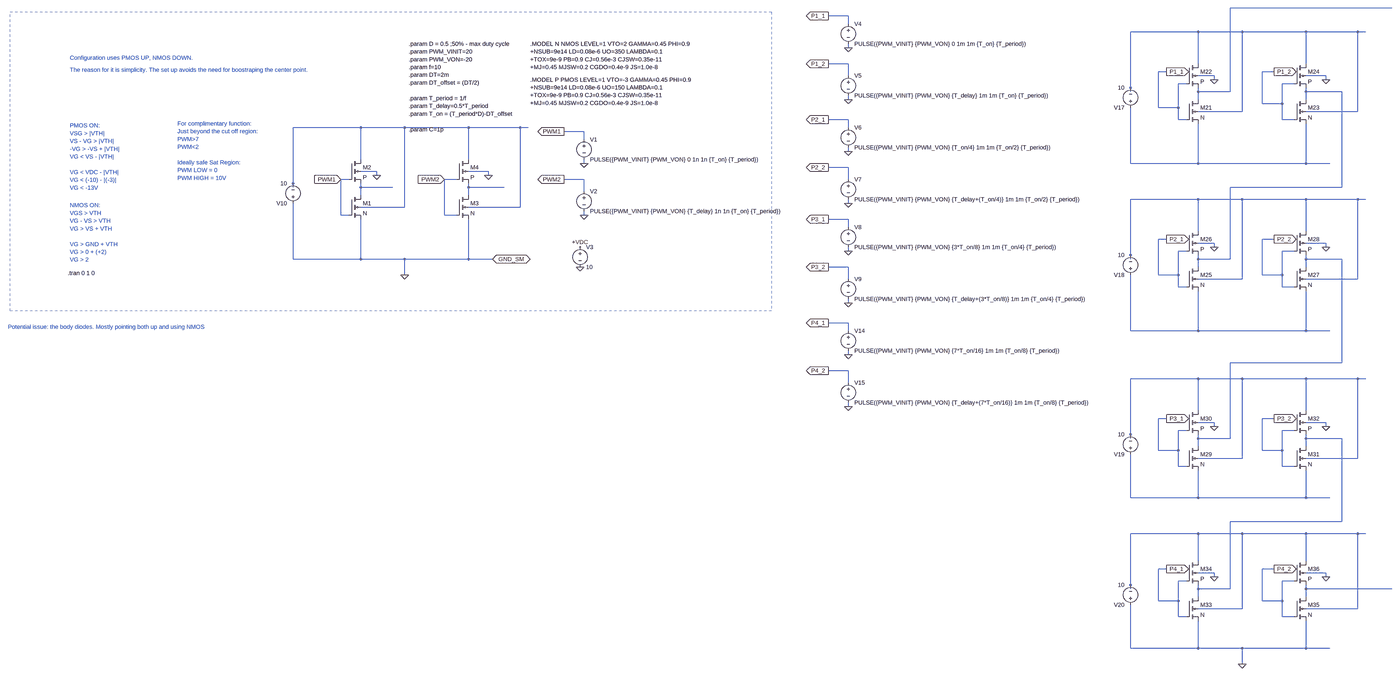
[diagram p0: schematic H-Bridge-4-SM.asc, whole sheet]
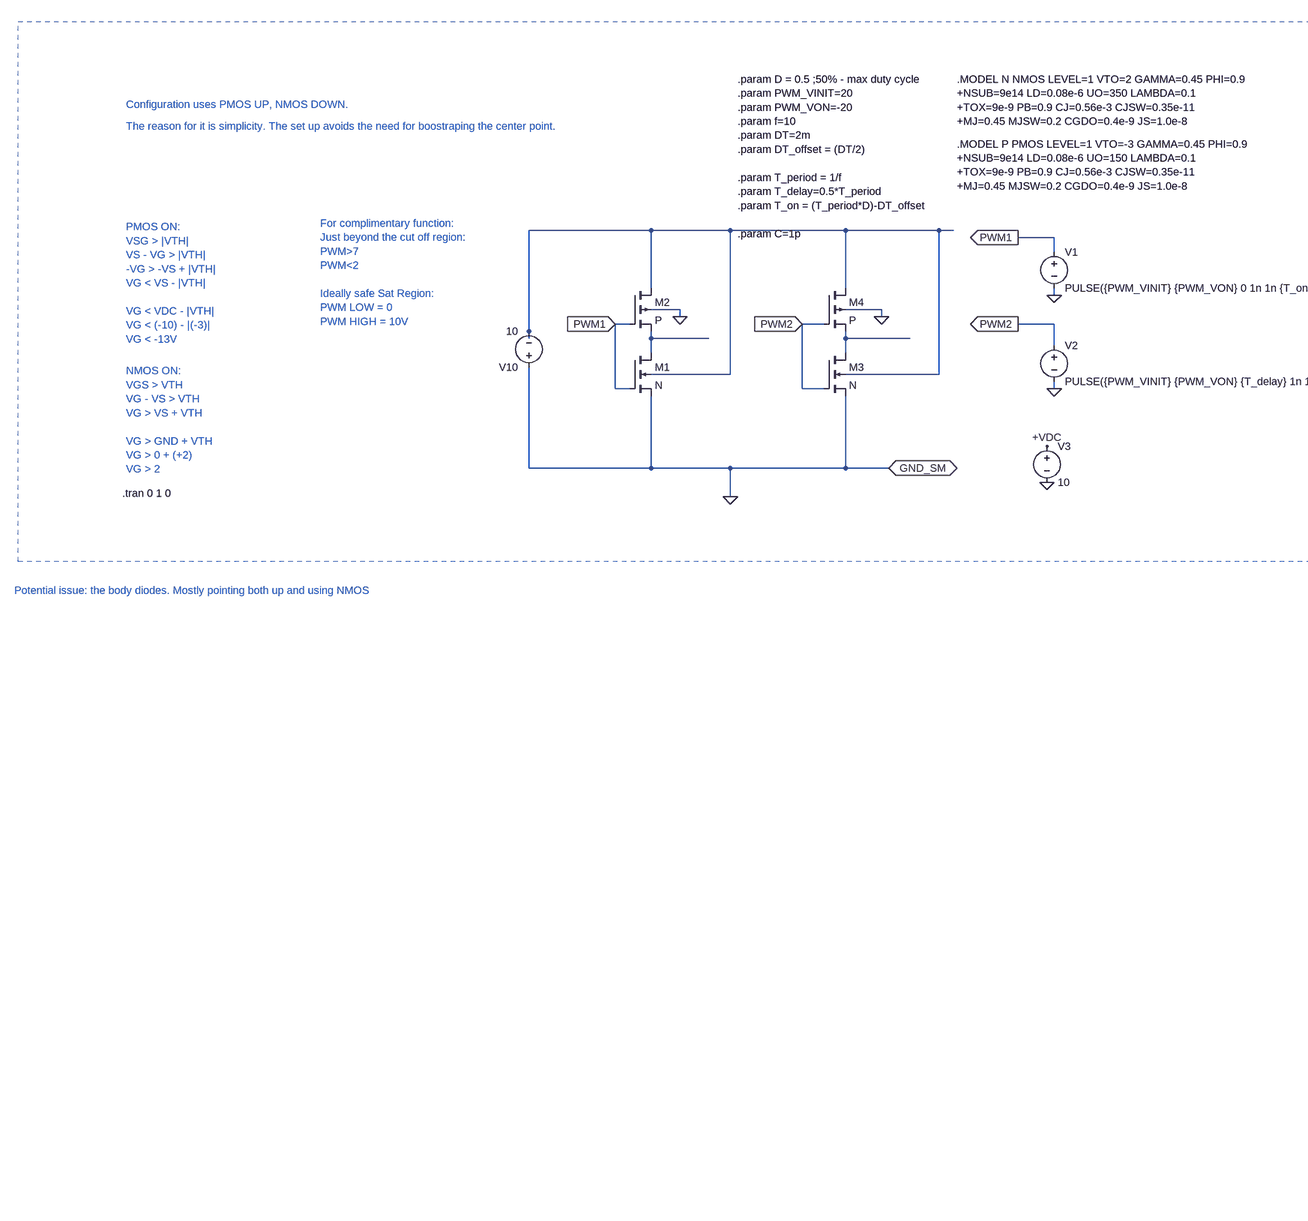
[diagram p1: schematic H-Bridge-4-SM.asc, part, row 1 of 1, column 1 of 2]
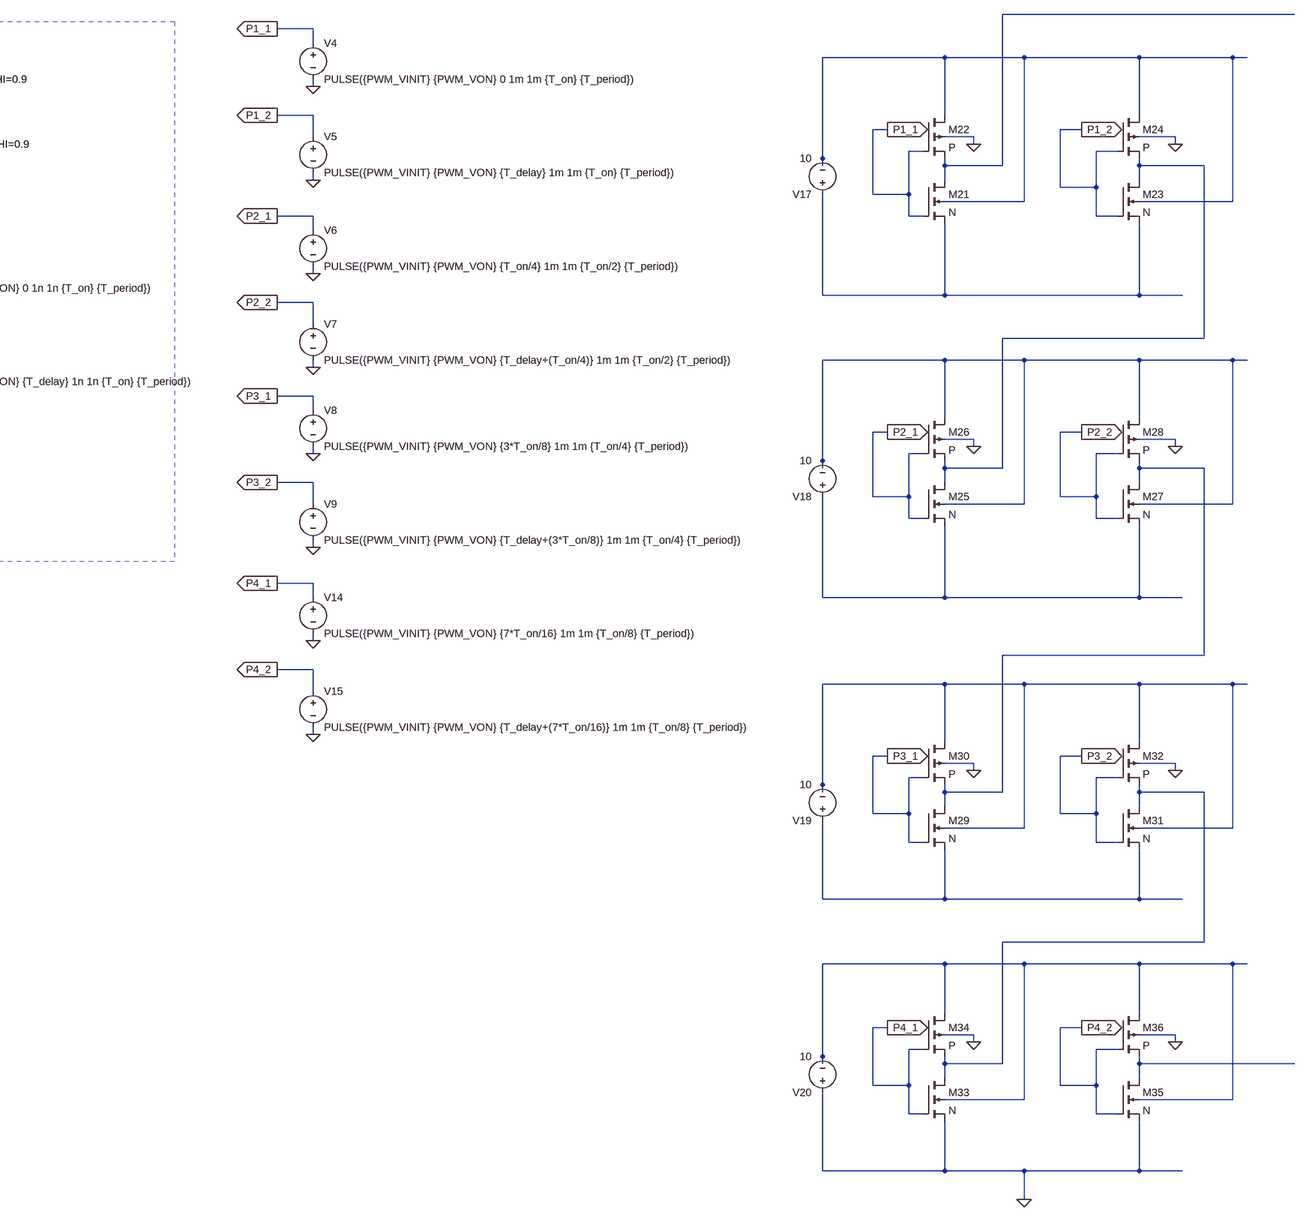
[diagram p2: schematic H-Bridge-4-SM.asc, part, row 1 of 1, column 2 of 2]
H-Bridge-4-SM.asc, the LTspice schematic file:
Version 4.1
SHEET 1 9444 2324
WIRE 6208 -448 5472 -448
WIRE 3856 -416 3776 -416
WIRE 3856 -384 3856 -416
WIRE 5344 -352 5072 -352
WIRE 5520 -352 5344 -352
WIRE 5776 -352 5520 -352
WIRE 5984 -352 5776 -352
WIRE 6016 -352 5984 -352
WIRE 3856 -288 3856 -304
WIRE 3856 -224 3776 -224
WIRE 5344 -224 5344 -352
WIRE 5776 -224 5776 -352
WIRE 5216 -192 5184 -192
WIRE 5648 -192 5600 -192
WIRE 3856 -176 3856 -224
WIRE 5408 -176 5344 -176
WIRE 5856 -176 5776 -176
WIRE 5408 -160 5408 -176
WIRE 5856 -160 5856 -176
WIRE 5296 -144 5264 -144
WIRE 5728 -144 5680 -144
WIRE 5072 -128 5072 -352
WIRE 5072 -112 5072 -128
WIRE 5344 -112 5344 -128
WIRE 5472 -112 5472 -448
WIRE 5472 -112 5344 -112
WIRE 5776 -112 5776 -128
WIRE 5920 -112 5776 -112
WIRE 3856 -80 3856 -96
WIRE 5344 -80 5344 -112
WIRE 5776 -80 5776 -112
WIRE 5600 -64 5600 -192
WIRE 5680 -64 5680 -144
WIRE 5680 -64 5600 -64
WIRE 5184 -48 5184 -192
WIRE 5264 -48 5264 -144
WIRE 5264 -48 5184 -48
WIRE 5520 -32 5520 -352
WIRE 5520 -32 5344 -32
WIRE 5984 -32 5984 -352
WIRE 5984 -32 5776 -32
WIRE 3856 0 3776 0
WIRE 5264 0 5264 -48
WIRE 5296 0 5264 0
WIRE 5680 0 5680 -64
WIRE 5728 0 5680 0
WIRE 1728 32 1456 32
WIRE 1904 32 1728 32
WIRE 2160 32 1904 32
WIRE 2368 32 2160 32
WIRE 2400 32 2368 32
WIRE 3856 32 3856 0
WIRE 2624 48 2544 48
WIRE 2624 80 2624 48
WIRE 3856 128 3856 112
WIRE 1728 160 1728 32
WIRE 2160 160 2160 32
WIRE 2624 176 2624 160
WIRE 5072 176 5072 -48
WIRE 5344 176 5344 16
WIRE 5344 176 5072 176
WIRE 5776 176 5776 16
WIRE 5776 176 5344 176
WIRE 5872 176 5776 176
WIRE 3856 192 3776 192
WIRE 1792 208 1728 208
WIRE 2240 208 2160 208
WIRE 1792 224 1792 208
WIRE 2240 224 2240 208
WIRE 1680 240 1648 240
WIRE 2112 240 2064 240
WIRE 2624 240 2544 240
WIRE 3856 240 3856 192
WIRE 1456 256 1456 32
WIRE 1456 272 1456 256
WIRE 1728 272 1728 256
WIRE 1856 272 1728 272
WIRE 2160 272 2160 256
WIRE 2304 272 2160 272
WIRE 5920 272 5920 -112
WIRE 5920 272 5472 272
WIRE 2624 288 2624 240
WIRE 1728 304 1728 272
WIRE 2160 304 2160 272
WIRE 5344 320 5072 320
WIRE 5520 320 5344 320
WIRE 5776 320 5520 320
WIRE 5984 320 5776 320
WIRE 6016 320 5984 320
WIRE 3856 336 3856 320
WIRE 1904 352 1904 32
WIRE 1904 352 1728 352
WIRE 2368 352 2368 32
WIRE 2368 352 2160 352
WIRE 1648 384 1648 240
WIRE 1680 384 1648 384
WIRE 2064 384 2064 240
WIRE 2112 384 2064 384
WIRE 2624 384 2624 368
WIRE 3856 400 3776 400
WIRE 3856 432 3856 400
WIRE 5344 448 5344 320
WIRE 5776 448 5776 320
WIRE 5216 480 5184 480
WIRE 5648 480 5600 480
WIRE 5408 496 5344 496
WIRE 5856 496 5776 496
WIRE 5408 512 5408 496
WIRE 5856 512 5856 496
WIRE 3856 528 3856 512
WIRE 5296 528 5264 528
WIRE 5728 528 5680 528
WIRE 5072 544 5072 320
WIRE 1456 560 1456 336
WIRE 1728 560 1728 400
WIRE 1728 560 1456 560
WIRE 1904 560 1728 560
WIRE 2160 560 2160 400
WIRE 2160 560 1904 560
WIRE 2256 560 2160 560
WIRE 5072 560 5072 544
WIRE 5344 560 5344 544
WIRE 5472 560 5472 272
WIRE 5472 560 5344 560
WIRE 5776 560 5776 544
WIRE 5920 560 5776 560
WIRE 3856 592 3776 592
WIRE 5344 592 5344 560
WIRE 5776 592 5776 560
WIRE 1904 624 1904 560
WIRE 5184 624 5184 480
WIRE 5264 624 5264 528
WIRE 5264 624 5184 624
WIRE 5600 624 5600 480
WIRE 5680 624 5680 528
WIRE 5680 624 5600 624
WIRE 3856 640 3856 592
WIRE 5520 640 5520 320
WIRE 5520 640 5344 640
WIRE 5984 640 5984 320
WIRE 5984 640 5776 640
WIRE 5264 672 5264 624
WIRE 5296 672 5264 672
WIRE 5680 672 5680 624
WIRE 5728 672 5680 672
WIRE 3856 736 3856 720
WIRE 3856 816 3776 816
WIRE 3856 848 3856 816
WIRE 5072 848 5072 624
WIRE 5344 848 5344 688
WIRE 5344 848 5072 848
WIRE 5776 848 5776 688
WIRE 5776 848 5344 848
WIRE 5872 848 5776 848
WIRE 3856 944 3856 928
WIRE 5920 976 5920 560
WIRE 5920 976 5472 976
WIRE 3856 1008 3776 1008
WIRE 5344 1040 5072 1040
WIRE 5520 1040 5344 1040
WIRE 5776 1040 5520 1040
WIRE 5984 1040 5776 1040
WIRE 6016 1040 5984 1040
WIRE 3856 1056 3856 1008
WIRE 3856 1152 3856 1136
WIRE 5344 1168 5344 1040
WIRE 5776 1168 5776 1040
WIRE 5216 1200 5184 1200
WIRE 5648 1200 5600 1200
WIRE 5408 1216 5344 1216
WIRE 5856 1216 5776 1216
WIRE 5408 1232 5408 1216
WIRE 5856 1232 5856 1216
WIRE 5296 1248 5264 1248
WIRE 5728 1248 5680 1248
WIRE 5072 1264 5072 1040
WIRE 5072 1280 5072 1264
WIRE 5344 1280 5344 1264
WIRE 5472 1280 5472 976
WIRE 5472 1280 5344 1280
WIRE 5776 1280 5776 1264
WIRE 5920 1280 5776 1280
WIRE 5344 1312 5344 1280
WIRE 5776 1312 5776 1280
WIRE 5184 1328 5184 1200
WIRE 5264 1328 5264 1248
WIRE 5264 1328 5184 1328
WIRE 5600 1328 5600 1200
WIRE 5680 1328 5680 1248
WIRE 5680 1328 5600 1328
WIRE 5520 1360 5520 1040
WIRE 5520 1360 5344 1360
WIRE 5984 1360 5984 1040
WIRE 5984 1360 5776 1360
WIRE 5264 1392 5264 1328
WIRE 5296 1392 5264 1392
WIRE 5680 1392 5680 1328
WIRE 5728 1392 5680 1392
WIRE 5072 1568 5072 1344
WIRE 5344 1568 5344 1408
WIRE 5344 1568 5072 1568
WIRE 5776 1568 5776 1408
WIRE 5776 1568 5344 1568
WIRE 5872 1568 5776 1568
WIRE 5920 1664 5920 1280
WIRE 5920 1664 5472 1664
WIRE 5344 1712 5072 1712
WIRE 5520 1712 5344 1712
WIRE 5776 1712 5520 1712
WIRE 5984 1712 5776 1712
WIRE 6016 1712 5984 1712
WIRE 5344 1840 5344 1712
WIRE 5776 1840 5776 1712
WIRE 5216 1872 5184 1872
WIRE 5648 1872 5600 1872
WIRE 5408 1888 5344 1888
WIRE 5856 1888 5776 1888
WIRE 5408 1904 5408 1888
WIRE 5856 1904 5856 1888
WIRE 5296 1920 5264 1920
WIRE 5728 1920 5680 1920
WIRE 5072 1936 5072 1712
WIRE 5072 1952 5072 1936
WIRE 5344 1952 5344 1936
WIRE 5472 1952 5472 1664
WIRE 5472 1952 5344 1952
WIRE 5776 1952 5776 1936
WIRE 6208 1952 5776 1952
WIRE 5344 1984 5344 1952
WIRE 5776 1984 5776 1952
WIRE 5184 2000 5184 1872
WIRE 5264 2000 5264 1920
WIRE 5264 2000 5184 2000
WIRE 5600 2000 5600 1872
WIRE 5680 2000 5680 1920
WIRE 5680 2000 5600 2000
WIRE 5520 2032 5520 1712
WIRE 5520 2032 5344 2032
WIRE 5984 2032 5984 1712
WIRE 5984 2032 5776 2032
WIRE 5264 2064 5264 2000
WIRE 5296 2064 5264 2064
WIRE 5680 2064 5680 2000
WIRE 5728 2064 5680 2064
WIRE 5072 2240 5072 2016
WIRE 5344 2240 5344 2080
WIRE 5344 2240 5072 2240
WIRE 5520 2240 5344 2240
WIRE 5776 2240 5776 2080
WIRE 5776 2240 5520 2240
WIRE 5872 2240 5776 2240
WIRE 5520 2304 5520 2240
FLAG 1648 240 PWM1
IOPIN 1648 240 In
FLAG 2064 240 PWM2
IOPIN 2064 240 In
FLAG 2624 176 0
FLAG 2624 384 0
FLAG 2544 48 PWM1
IOPIN 2544 48 Out
FLAG 2544 240 PWM2
IOPIN 2544 240 Out
FLAG 2256 560 GND_SM
IOPIN 2256 560 BiDir
FLAG 2608 512 +VDC
FLAG 2608 592 0
FLAG 1904 624 0
FLAG 3856 -288 0
FLAG 3856 -80 0
FLAG 3776 -416 P1_1
IOPIN 3776 -416 Out
FLAG 3776 -224 P1_2
IOPIN 3776 -224 Out
FLAG 3856 128 0
FLAG 3856 336 0
FLAG 3776 0 P2_1
IOPIN 3776 0 Out
FLAG 3776 192 P2_2
IOPIN 3776 192 Out
FLAG 3856 528 0
FLAG 3856 736 0
FLAG 3776 400 P3_1
IOPIN 3776 400 Out
FLAG 3776 592 P3_2
IOPIN 3776 592 Out
FLAG 3856 944 0
FLAG 3856 1152 0
FLAG 3776 816 P4_1
IOPIN 3776 816 Out
FLAG 3776 1008 P4_2
IOPIN 3776 1008 Out
FLAG 1792 224 0
FLAG 2240 224 0
FLAG 5408 -160 0
FLAG 5856 -160 0
FLAG 5408 512 0
FLAG 5856 512 0
FLAG 5408 1232 0
FLAG 5856 1232 0
FLAG 5520 2304 0
FLAG 5408 1904 0
FLAG 5856 1904 0
FLAG 5216 -192 P1_1
IOPIN 5216 -192 Out
FLAG 5648 -192 P1_2
IOPIN 5648 -192 Out
FLAG 5216 480 P2_1
IOPIN 5216 480 Out
FLAG 5648 480 P2_2
IOPIN 5648 480 Out
FLAG 5216 1200 P3_1
IOPIN 5216 1200 Out
FLAG 5648 1200 P3_2
IOPIN 5648 1200 Out
FLAG 5216 1872 P4_1
IOPIN 5216 1872 Out
FLAG 5648 1872 P4_2
IOPIN 5648 1872 Out
SYMBOL nmos4 1680 304 R0
SYMATTR InstName M1
SYMATTR Value N
SYMBOL pmos4 1680 160 R0
SYMATTR InstName M2
SYMATTR Value P
SYMBOL nmos4 2112 304 R0
SYMATTR InstName M3
SYMATTR Value N
SYMBOL pmos4 2112 160 R0
SYMATTR InstName M4
SYMATTR Value P
SYMBOL voltage 2624 64 R0
WINDOW 123 0 0 Left 0
WINDOW 39 0 0 Left 0
SYMATTR InstName V1
SYMATTR Value PULSE({PWM_VINIT} {PWM_VON} 0 1n 1n {T_on} {T_period})
SYMBOL voltage 2624 272 R0
WINDOW 123 0 0 Left 0
WINDOW 39 0 0 Left 0
SYMATTR InstName V2
SYMATTR Value PULSE({PWM_VINIT} {PWM_VON} {T_delay} 1n 1n {T_on} {T_period})
SYMBOL voltage 2608 496 R0
WINDOW 123 0 0 Left 0
WINDOW 39 0 0 Left 0
SYMATTR InstName V3
SYMATTR Value 10
SYMBOL voltage 3856 -400 R0
WINDOW 123 0 0 Left 0
WINDOW 39 0 0 Left 0
SYMATTR InstName V4
SYMATTR Value PULSE({PWM_VINIT} {PWM_VON} 0 1m 1m {T_on} {T_period})
SYMBOL voltage 3856 -192 R0
WINDOW 123 0 0 Left 0
WINDOW 39 0 0 Left 0
SYMATTR InstName V5
SYMATTR Value PULSE({PWM_VINIT} {PWM_VON} {T_delay} 1m 1m {T_on} {T_period})
SYMBOL voltage 3856 16 R0
WINDOW 123 0 0 Left 0
WINDOW 39 0 0 Left 0
SYMATTR InstName V6
SYMATTR Value PULSE({PWM_VINIT} {PWM_VON} {T_on/4} 1m 1m {T_on/2} {T_period})
SYMBOL voltage 3856 224 R0
WINDOW 123 0 0 Left 0
WINDOW 39 0 0 Left 0
SYMATTR InstName V7
SYMATTR Value PULSE({PWM_VINIT} {PWM_VON} {T_delay+(T_on/4)} 1m 1m {T_on/2} {T_period})
SYMBOL voltage 3856 416 R0
WINDOW 123 0 0 Left 0
WINDOW 39 0 0 Left 0
SYMATTR InstName V8
SYMATTR Value PULSE({PWM_VINIT} {PWM_VON} {3*T_on/8} 1m 1m {T_on/4} {T_period})
SYMBOL voltage 3856 624 R0
WINDOW 123 0 0 Left 0
WINDOW 39 0 0 Left 0
SYMATTR InstName V9
SYMATTR Value PULSE({PWM_VINIT} {PWM_VON} {T_delay+(3*T_on/8)} 1m 1m {T_on/4} {T_period})
SYMBOL voltage 1456 352 R180
WINDOW 123 0 0 Left 0
WINDOW 39 0 0 Left 0
SYMATTR InstName V10
SYMATTR Value 10
SYMBOL voltage 3856 832 R0
WINDOW 123 0 0 Left 0
WINDOW 39 0 0 Left 0
SYMATTR InstName V14
SYMATTR Value PULSE({PWM_VINIT} {PWM_VON} {7*T_on/16} 1m 1m {T_on/8} {T_period})
SYMBOL voltage 3856 1040 R0
WINDOW 123 0 0 Left 0
WINDOW 39 0 0 Left 0
SYMATTR InstName V15
SYMATTR Value PULSE({PWM_VINIT} {PWM_VON} {T_delay+(7*T_on/16)} 1m 1m {T_on/8} {T_period})
SYMBOL nmos4 5296 -80 R0
SYMATTR InstName M21
SYMATTR Value N
SYMBOL pmos4 5296 -224 R0
SYMATTR InstName M22
SYMATTR Value P
SYMBOL nmos4 5728 -80 R0
SYMATTR InstName M23
SYMATTR Value N
SYMBOL pmos4 5728 -224 R0
SYMATTR InstName M24
SYMATTR Value P
SYMBOL voltage 5072 -32 R180
WINDOW 123 0 0 Left 0
WINDOW 39 0 0 Left 0
SYMATTR InstName V17
SYMATTR Value 10
SYMBOL nmos4 5296 592 R0
SYMATTR InstName M25
SYMATTR Value N
SYMBOL pmos4 5296 448 R0
SYMATTR InstName M26
SYMATTR Value P
SYMBOL nmos4 5728 592 R0
SYMATTR InstName M27
SYMATTR Value N
SYMBOL pmos4 5728 448 R0
SYMATTR InstName M28
SYMATTR Value P
SYMBOL voltage 5072 640 R180
WINDOW 123 0 0 Left 0
WINDOW 39 0 0 Left 0
SYMATTR InstName V18
SYMATTR Value 10
SYMBOL nmos4 5296 1312 R0
SYMATTR InstName M29
SYMATTR Value N
SYMBOL pmos4 5296 1168 R0
SYMATTR InstName M30
SYMATTR Value P
SYMBOL nmos4 5728 1312 R0
SYMATTR InstName M31
SYMATTR Value N
SYMBOL pmos4 5728 1168 R0
SYMATTR InstName M32
SYMATTR Value P
SYMBOL voltage 5072 1360 R180
WINDOW 123 0 0 Left 0
WINDOW 39 0 0 Left 0
SYMATTR InstName V19
SYMATTR Value 10
SYMBOL nmos4 5296 1984 R0
SYMATTR InstName M33
SYMATTR Value N
SYMBOL pmos4 5296 1840 R0
SYMATTR InstName M34
SYMATTR Value P
SYMBOL nmos4 5728 1984 R0
SYMATTR InstName M35
SYMATTR Value N
SYMBOL pmos4 5728 1840 R0
SYMATTR InstName M36
SYMATTR Value P
SYMBOL voltage 5072 2032 R180
WINDOW 123 0 0 Left 0
WINDOW 39 0 0 Left 0
SYMATTR InstName V20
SYMATTR Value 10
TEXT 2408 -304 Left 2 !.MODEL N NMOS LEVEL=1 VTO=2 GAMMA=0.45 PHI=0.9\n+NSUB=9e14 LD=0.08e-6 UO=350 LAMBDA=0.1\n+TOX=9e-9 PB=0.9 CJ=0.56e-3 CJSW=0.35e-11\n+MJ=0.45 MJSW=0.2 CGDO=0.4e-9 JS=1.0e-8
TEXT 2408 -160 Left 2 !.MODEL P PMOS LEVEL=1 VTO=-3 GAMMA=0.45 PHI=0.9\n+NSUB=9e14 LD=0.08e-6 UO=150 LAMBDA=0.1\n+TOX=9e-9 PB=0.9 CJ=0.56e-3 CJSW=0.35e-11\n+MJ=0.45 MJSW=0.2 CGDO=0.4e-9 JS=1.0e-8
TEXT 560 -248 Left 2 ;Configuration uses PMOS UP, NMOS DOWN.
TEXT 560 -200 Left 2 ;The reason for it is simplicity. The set up avoids the need for boostraping the center point.
TEXT 560 24 Left 2 ;PMOS ON: \nVSG > |VTH| \nVS - VG > |VTH| \n-VG > -VS + |VTH| \nVG < VS - |VTH| \n \nVG < VDC - |VTH| \nVG < (-10) - |(-3)|\nVG < -13V
TEXT 560 344 Left 2 ;NMOS ON:\nVGS > VTH\nVG - VS > VTH \nVG > VS + VTH\n \nVG > GND + VTH \nVG > 0 + (+2) \nVG > 2
TEXT 992 16 Left 2 ;For complimentary function: \nJust beyond the cut off region: \nPWM>7 \nPWM<2\n \nIdeally safe Sat Region: \nPWM LOW = 0\nPWM HIGH = 10V
TEXT 552 616 Left 2 !.tran 0 1 0
TEXT 1920 -304 Left 2 !.param D = 0.5 ;50% - max duty cycle\n.param PWM_VINIT=20\n.param PWM_VON=-20\n.param f=10\n.param DT=2m\n.param DT_offset = (DT/2)\n \n.param T_period = 1/f\n.param T_delay=0.5*T_period\n.param T_on = (T_period*D)-DT_offset\n \n.param C=1p
TEXT 312 832 Left 2 ;Potential issue: the body diodes. Mostly pointing both up and using NMOS
RECTANGLE Normal 3376 768 320 -432 2

The netlist it stands for:
* H-Bridge-4-SM.asc
M1 N006 PWM1 0 N004 N
M2 N004 PWM1 N006 0 P
M3 N007 PWM2 0 N004 N
M4 N004 PWM2 N007 0 P
V1 PWM1 0 PULSE({PWM_VINIT} {PWM_VON} 0 1n 1n {T_on} {T_period})
V2 PWM2 0 PULSE({PWM_VINIT} {PWM_VON} {T_delay} 1n 1n {T_on} {T_period})
V3 +VDC 0 10
V4 P1_1 0 PULSE({PWM_VINIT} {PWM_VON} 0 1m 1m {T_on} {T_period})
V5 P1_2 0 PULSE({PWM_VINIT} {PWM_VON} {T_delay} 1m 1m {T_on} {T_period})
V6 P2_1 0 PULSE({PWM_VINIT} {PWM_VON} {T_on/4} 1m 1m {T_on/2} {T_period})
V7 P2_2 0 PULSE({PWM_VINIT} {PWM_VON} {T_delay+(T_on/4)} 1m 1m {T_on/2} {T_period})
V8 P3_1 0 PULSE({PWM_VINIT} {PWM_VON} {3*T_on/8} 1m 1m {T_on/4} {T_period})
V9 P3_2 0 PULSE({PWM_VINIT} {PWM_VON} {T_delay+(3*T_on/8)} 1m 1m {T_on/4} {T_period})
V10 0 N004 10
V14 P4_1 0 PULSE({PWM_VINIT} {PWM_VON} {7*T_on/16} 1m 1m {T_on/8} {T_period})
V15 P4_2 0 PULSE({PWM_VINIT} {PWM_VON} {T_delay+(7*T_on/16)} 1m 1m {T_on/8} {T_period})
M21 N001 P1_1 N005 N002 N
M22 N002 P1_1 N001 0 P
M23 N003 P1_2 N005 N002 N
M24 N002 P1_2 N003 0 P
V17 N005 N002 10
M25 N003 P2_1 N010 N008 N
M26 N008 P2_1 N003 0 P
M27 N009 P2_2 N010 N008 N
M28 N008 P2_2 N009 0 P
V18 N010 N008 10
M29 N009 P3_1 N013 N011 N
M30 N011 P3_1 N009 0 P
M31 N012 P3_2 N013 N011 N
M32 N011 P3_2 N012 0 P
V19 N013 N011 10
M33 N012 P4_1 0 N014 N
M34 N014 P4_1 N012 0 P
M35 N015 P4_2 0 N014 N
M36 N014 P4_2 N015 0 P
V20 0 N014 10
.model NMOS NMOS
.model PMOS PMOS
.lib standard.mos
.MODEL N NMOS LEVEL=1 VTO=2 GAMMA=0.45 PHI=0.9
+NSUB=9e14 LD=0.08e-6 UO=350 LAMBDA=0.1
+TOX=9e-9 PB=0.9 CJ=0.56e-3 CJSW=0.35e-11
+MJ=0.45 MJSW=0.2 CGDO=0.4e-9 JS=1.0e-8
.MODEL P PMOS LEVEL=1 VTO=-3 GAMMA=0.45 PHI=0.9
+NSUB=9e14 LD=0.08e-6 UO=150 LAMBDA=0.1
+TOX=9e-9 PB=0.9 CJ=0.56e-3 CJSW=0.35e-11
+MJ=0.45 MJSW=0.2 CGDO=0.4e-9 JS=1.0e-8
* Configuration uses PMOS UP, NMOS DOWN.
* The reason for it is simplicity. The set up avoids the need for boostraping the center point.
* PMOS ON:
* VSG > |VTH|
* VS - VG > |VTH|
* -VG > -VS + |VTH|
* VG < VS - |VTH|
* VG < VDC - |VTH|
* VG < (-10) - |(-3)|
* VG < -13V
* NMOS ON:
* VGS > VTH
* VG - VS > VTH
* VG > VS + VTH
* VG > GND + VTH
* VG > 0 + (+2)
* VG > 2
* For complimentary function:
* Just beyond the cut off region:
* PWM>7
* PWM<2
* Ideally safe Sat Region:
* PWM LOW = 0
* PWM HIGH = 10V
.tran 0 1 0
.param D = 0.5 ;50% - max duty cycle
.param PWM_VINIT=20
.param PWM_VON=-20
.param f=10
.param DT=2m
.param DT_offset = (DT/2)
.param T_period = 1/f
.param T_delay=0.5*T_period
.param T_on = (T_period*D)-DT_offset
.param C=1p
* Potential issue: the body diodes. Mostly pointing both up and using NMOS
.backanno
.end